# Altium schematic sheet DIGITAL_OUTPUT.SchDoc
size A
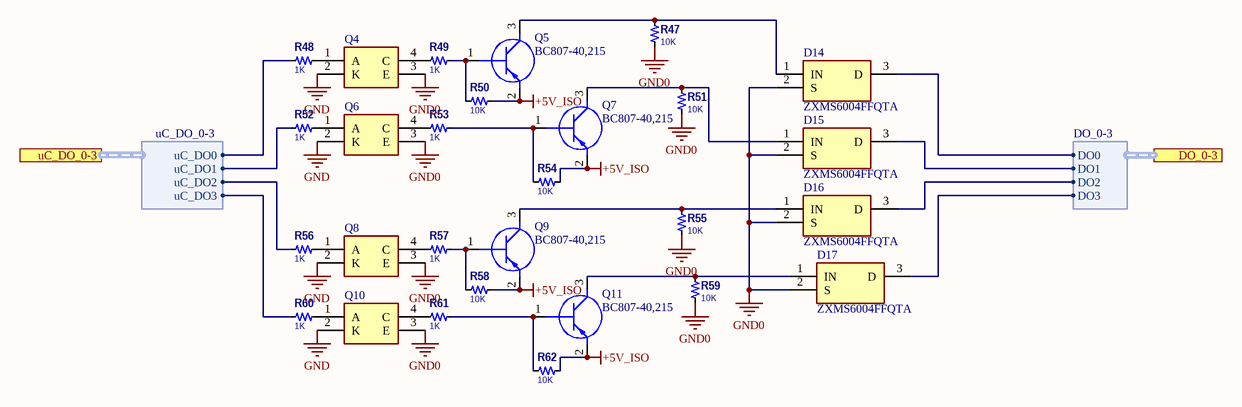
[diagram p0: DIGITAL_OUTPUT.SchDoc]

## Parts
D14  ZXMS6004FFQTA  [SOTFL95P240X100-3N]
D15  ZXMS6004FFQTA  [SOTFL95P240X100-3N]
D16  ZXMS6004FFQTA  [SOTFL95P240X100-3N]
D17  ZXMS6004FFQTA  [SOTFL95P240X100-3N]
Q4  TLX9291A_GBTPL,F  [SOIC127P700X230-4N]  (value not drawn)
Q5  BC807-40,215  [SOT95P230X110-3N]
Q6  TLX9291A_GBTPL,F  [SOIC127P700X230-4N]  (value not drawn)
Q7  BC807-40,215  [SOT95P230X110-3N]
Q8  TLX9291A_GBTPL,F  [SOIC127P700X230-4N]  (value not drawn)
Q9  BC807-40,215  [SOT95P230X110-3N]
Q10  TLX9291A_GBTPL,F  [SOIC127P700X230-4N]  (value not drawn)
Q11  BC807-40,215  [SOT95P230X110-3N]
R47  10K  [0603-R]
R48  1K  [0603-R]
R49  1K  [0603-R]
R50  10K  [0603-R]
R51  10K  [0603-R]
R52  1K  [0603-R]
R53  1K  [0603-R]
R54  10K  [0603-R]
R55  10K  [0603-R]
R56  1K  [0603-R]
R57  1K  [0603-R]
R58  10K  [0603-R]
R59  10K  [0603-R]
R60  1K  [0603-R]
R61  1K  [0603-R]
R62  10K  [0603-R]

## Ports
DO_0-3 (harness DO_0-3), uC_DO_0-3 (harness uC_DO_0-3)

## Harnesses
DO_0-3: DO0, DO1, DO2, DO3
uC_DO_0-3: uC_DO0, uC_DO1, uC_DO2, uC_DO3

## Nets
+5V_ISO: Q5.2(E) Q7.2(E) Q9.2(E) Q11.2(E) R50.2 R54.2 R58.2 R62.2
GND: Q4.2(K) Q6.2(K) Q8.2(K) Q10.2(K)
GND0: D14.2(S) D15.2(S) D16.2(S) D17.2(S) Q4.3(E) Q6.3(E) Q8.3(E) Q10.3(E) R47.1 R51.1 R55.1 R59.1
NetD14_1: D14.1(IN) Q5.3(C) R47.2
NetD14_3: D14.3(D) ; port DO_0-3.DO0
NetD15_1: D15.1(IN) Q7.3(C) R51.2
NetD15_3: D15.3(D) ; port DO_0-3.DO1
NetD16_1: D16.1(IN) Q9.3(C) R55.2
NetD16_3: D16.3(D) ; port DO_0-3.DO2
NetD17_1: D17.1(IN) Q11.3(C) R59.2
NetD17_3: D17.3(D) ; port DO_0-3.DO3
NetQ4_1: Q4.1(A) R48.2
NetQ4_4: Q4.4(C) R49.1
NetQ5_1: Q5.1(B) R49.2 R50.1
NetQ6_1: Q6.1(A) R52.2
NetQ6_4: Q6.4(C) R53.1
NetQ7_1: Q7.1(B) R53.2 R54.1
NetQ8_1: Q8.1(A) R56.2
NetQ8_4: Q8.4(C) R57.1
NetQ9_1: Q9.1(B) R57.2 R58.1
NetQ10_1: Q10.1(A) R60.2
NetQ10_4: Q10.4(C) R61.1
NetQ11_1: Q11.1(B) R61.2 R62.1
NetR48_1: R48.1 ; port uC_DO_0-3.uC_DO0
NetR52_1: R52.1 ; port uC_DO_0-3.uC_DO1
NetR56_1: R56.1 ; port uC_DO_0-3.uC_DO2
NetR60_1: R60.1 ; port uC_DO_0-3.uC_DO3

## Library data of the parts
D14-D17 = ZXMS6004FFQTA: Diode; Manufacturer_Name: Diodes Inc.; Datasheet Link: https://www.diodes.com/assets/Datasheets/ZXMS6004FFQ.pdf; Height: 1mm; Manufacturer_Part_Number: ZXMS6004FFQTA; Mouser Part Number: 621-ZXMS6004FFQTA; Mouser Price/Stock: https://www.mouser.co.uk/ProductDetail/Diodes-Incorporated/ZXMS6004FFQTA?qs=nVS1qgv%252BQrk3b3Yw041IKA%3D%3D; Arrow Part Number: ZXMS6004FFQTA; Arrow Price/Stock: https://www.arrow.com/en/products/zxms6004ffqta/diodes-incorporated?region=nac
Q4 Q6 Q8 Q10 = TLX9291A_GBTPL,F: Phototransistor; Manufacturer_Name: Toshiba; Manufacturer_Part_Number: TLX9291A(GBTPL,F; Datasheet Link: https://toshiba.semicon-storage.com/info/docget.jsp?did=53137&prodName=TLX9291A; Height: 2.3mm; Mouser Part Number: 757-TLX9291AGBTPLF; Mouser Price/Stock: https://www.mouser.co.uk/ProductDetail/Toshiba/TLX9291AGBTPLF?qs=YwPsRIUVAOcOvZScDNZO1w%3D%3D
Q5 Q7 Q9 Q11 = BC807-40,215: Transistor BJT PNP; Manufacturer_Name: Nexperia; Datasheet Link: https://assets.nexperia.com/documents/data-sheet/BC807_SER.pdf; Height: 1.1mm; Manufacturer_Part_Number: BC807-40,215; Mouser Part Number: 771-BC807-40-T/R; Mouser Price/Stock: https://www.mouser.co.uk/ProductDetail/Nexperia/BC807-40215?qs=me8TqzrmIYUR795aoYEBCw%3D%3D; Arrow Part Number: BC807-40,215; Arrow Price/Stock: https://www.arrow.com/en/products/bc807-40215/nexperia?region=europe
R47-R62 = Res_2: Manufacturer: Panasonic; Manufacturer Part Number: ERJ-8GEYJ621V; Resistance: 620R; Tolerance: 5%; Voltage Rating: 200V; Temperature Coefficient: 200ppm/°C; Max Power Dissipation: 250mW; ComponentLink1URL: https://datasheet.ciiva.com/15193/getdatasheetpartid-366470-15193725.pdf?src-supplier=Verical; ComponentLink1Description: Datasheet; Supplier 1: Avnet; Stock 1: 6255; Pricing 1: 1 = 0.01200 (USD); RoHS: Yes; Mount: Surface Mount; Case Code (Metric): 3216; Case Code (Imperial): 1206; Contact Plating: Tin; Min Operating Temperature: -55°C; Max Operating Temperature: 155°C; Packaging: Tape and Reel; Package Quantity: 1; Resistor Type: Thick Film; Number of Terminations: 2; Voltage Rating (DC): 200V; Features: Automotive AEC-Q200; Series: ERJ; Construction: Rectangular; Resistance Tolerance: 5%; Length: 3.2mm; Width: 0.063inch; Height: 0.028inch; Depth: 1.6mm; Radiation Hardening: No; REACH SVHC: No SVHC; Military Standard: Not; Lead Free: Lead Free; RoHS Compliant: Yes; ComponentLink2URL: https://datasheet.ciiva.com/46387/1500035-46387094.pdf?src-supplier=Element14; ComponentLink2Description: https://datasheet.ciiva.com/46387/1500035-46387094.pdf?src-supplier=Element14; ComponentLink3URL: https://datasheet.ciiva.com/5915/1500035-5915369.pdf?src-supplier=Farnell; ComponentLink3Description: https://datasheet.ciiva.com/5915/1500035-5915369.pdf?src-supplier=Farnell; ComponentLink4URL: https://datasheet.ciiva.com/28677/1678796-28677018.pdf?src-supplier=Element14; ComponentLink4Description: https://datasheet.ciiva.com/28677/1678796-28677018.pdf?src-supplier=Element14; ComponentLink5URL: https://datasheet.ciiva.com/17204/aoa0000ce1-17204972.pdf?src-supplier=Avnet+Europe; ComponentLink5Description: https://datasheet.ciiva.com/17204/aoa0000ce1-17204972.pdf?src-supplier=Avnet+Europe; ComponentLink6URL: https://datasheet.ciiva.com/16515/aoa0000ce1-16515933.pdf?src-supplier=Avnet+Asia; ComponentLink6Description: https://datasheet.ciiva.com/16515/aoa0000ce1-16515933.pdf?src-supplier=Avnet+Asia; Supplier Part Number 1: 65T8955; Power Rating: 250mW; Case/Package: 0603